# Altium schematic sheet Big_logger.SchDoc
size A1
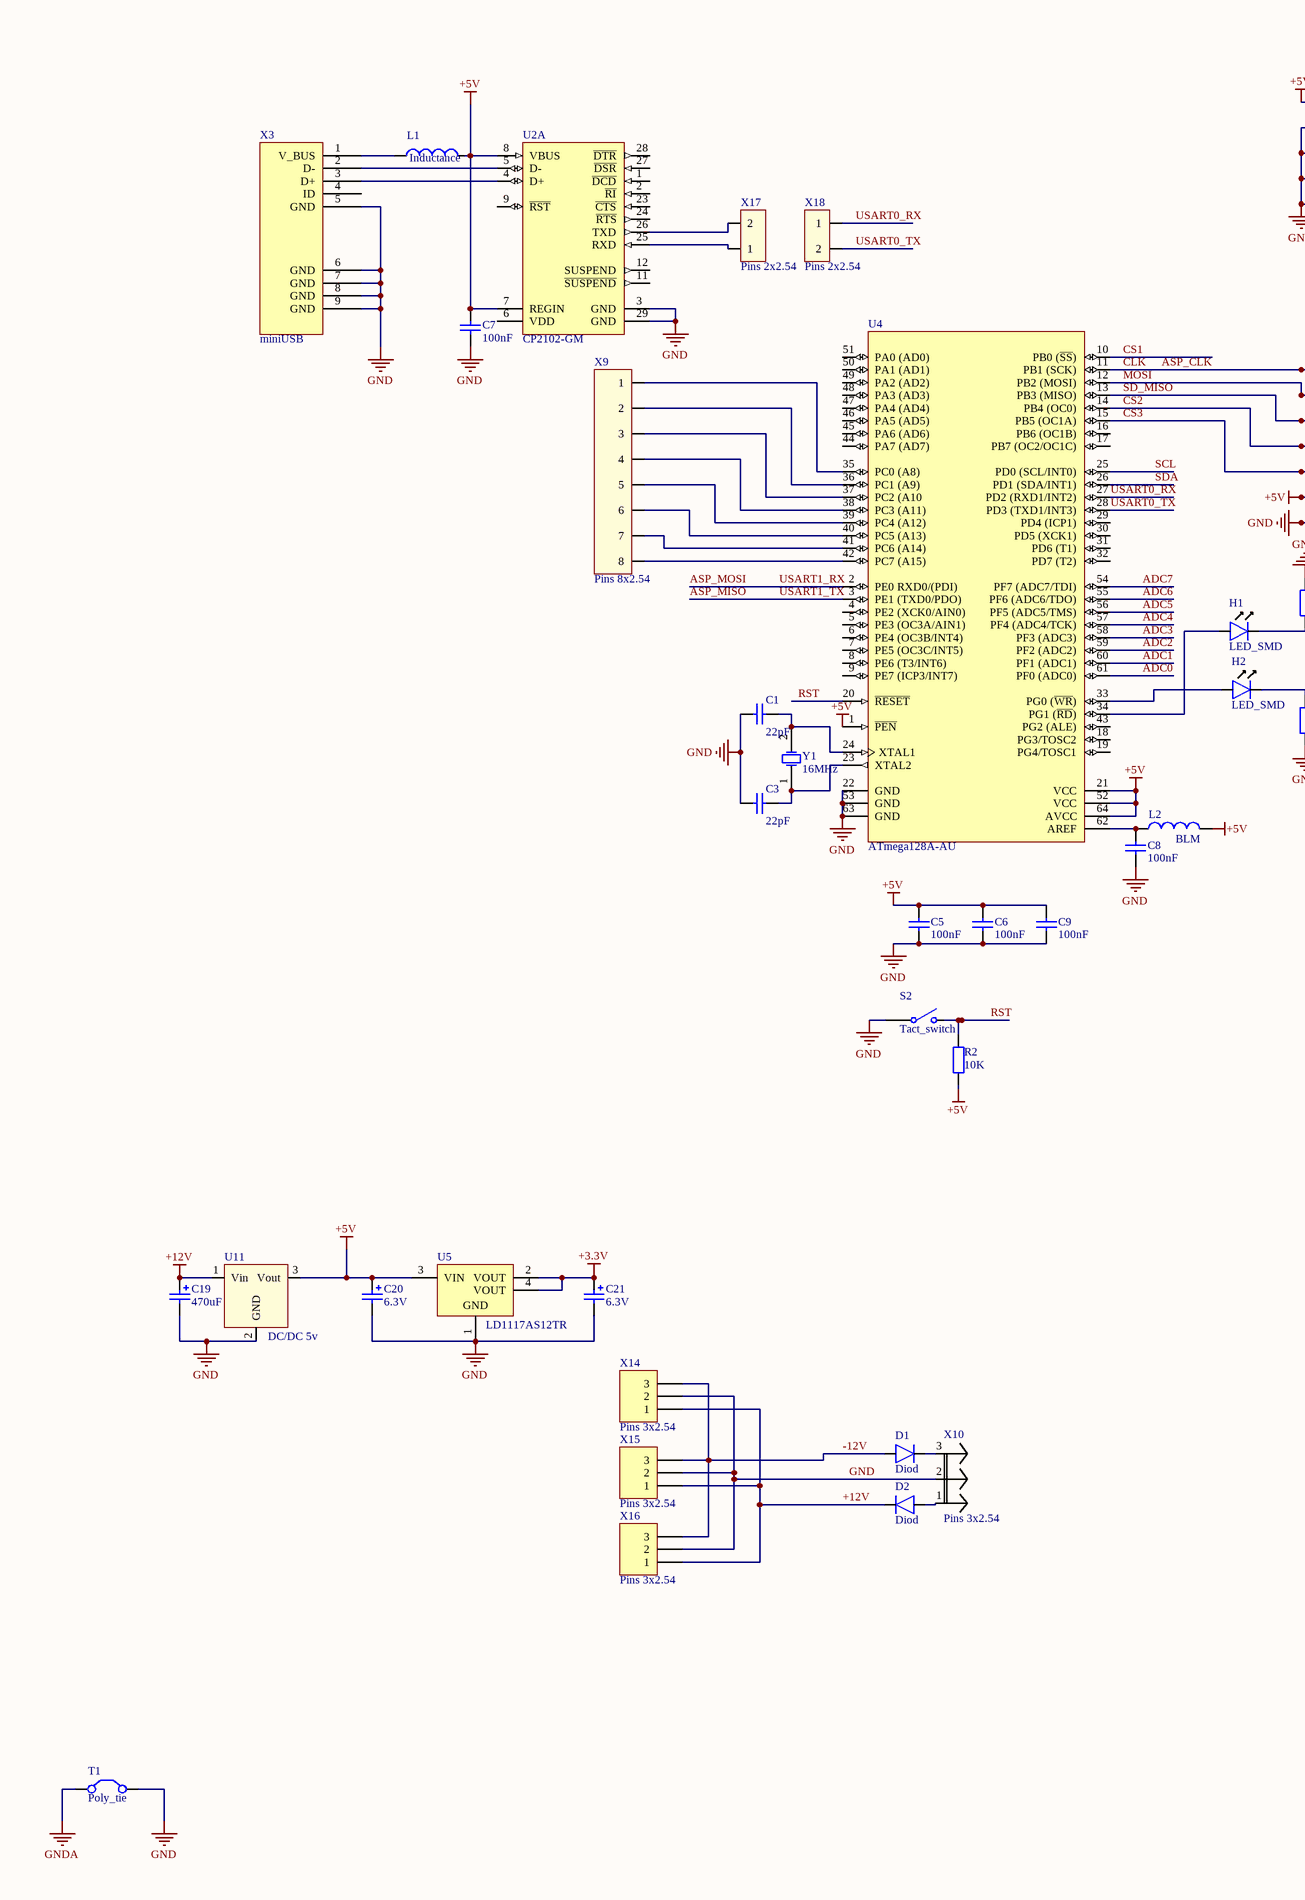
[diagram p0: Big_logger.SchDoc, left]
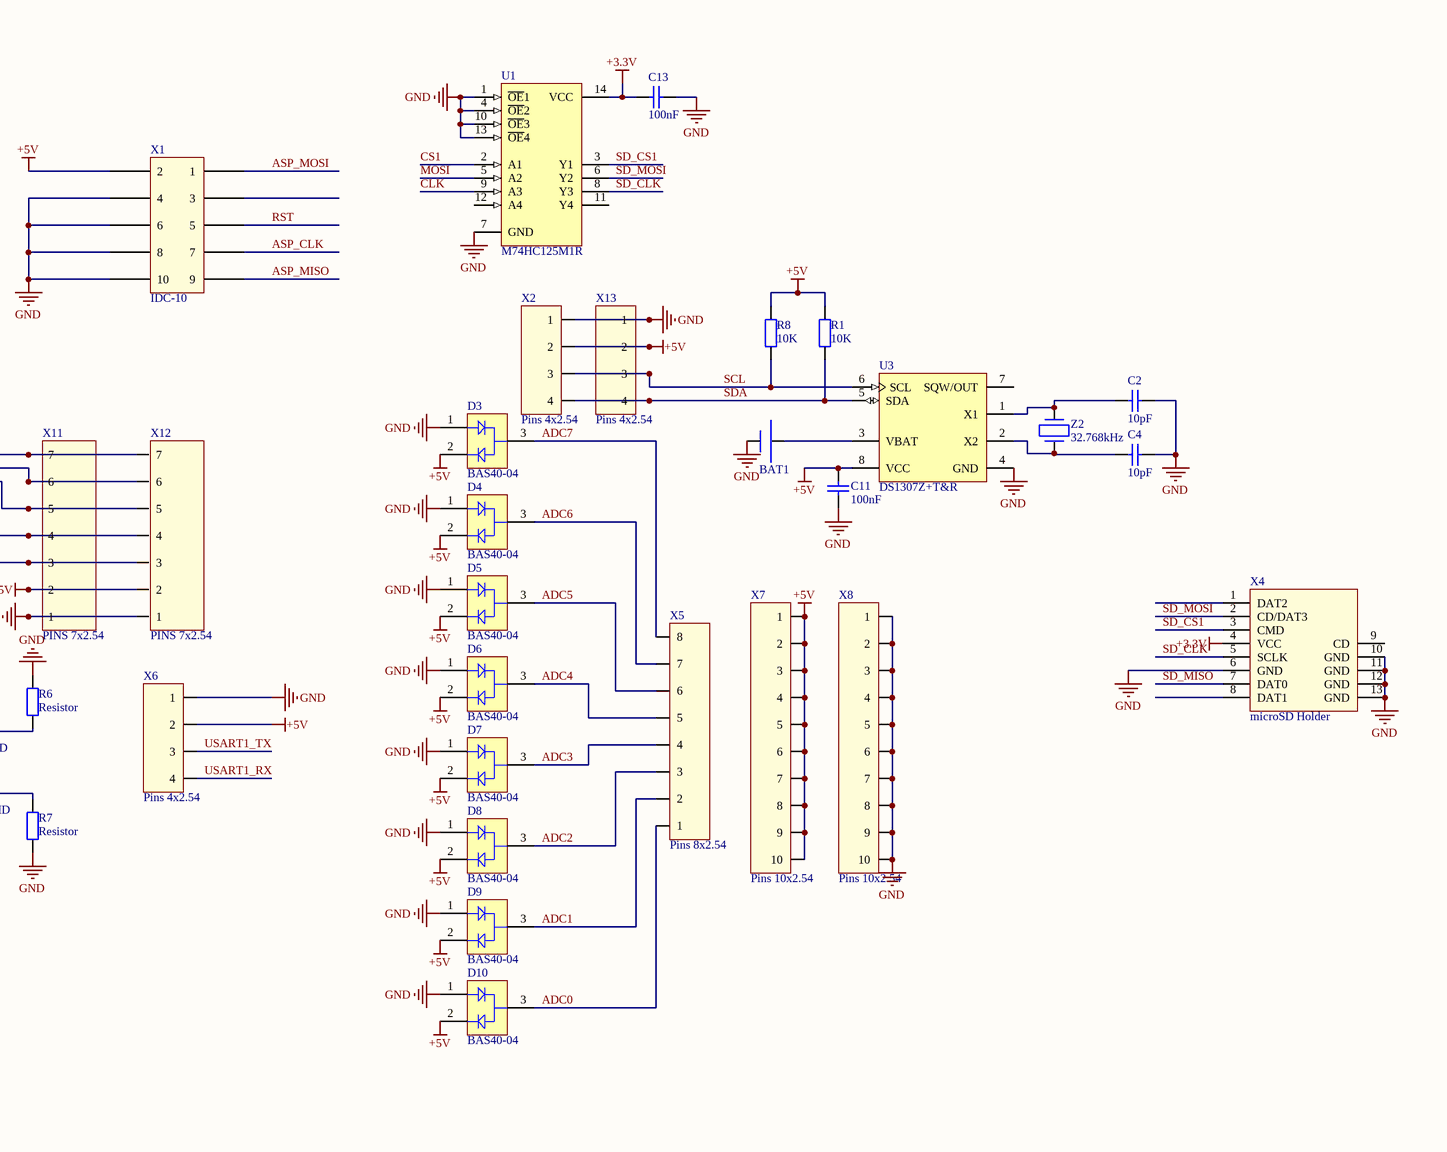
[diagram p1: Big_logger.SchDoc, right]

## Parts
BAT1  CR2032_Holder_BH-642  [BH-642(CR2032)]  (value not drawn)
C1  22pF  [C0805]
C2  10pF  [C0805]
C3  22pF  [C0805]
C4  10pF  [C0805]
C5  100nF  [C0805]
C6  100nF  [C0805]
C7  100nF  [C0805]
C8  100nF  [C0805]
C9  100nF  [C0805]
C11  100nF  [C0805]
C13  100nF  [C0805]
C19  470uF  [Cap_El_SMD_10mm]
C20  6.3V  [CAP_EL_SMD_6.3mm]
C21  6.3V  [CAP_EL_SMD_6.3mm]
D1  Diod  [SMB_DIODE]
D2  Diod  [SMB_DIODE]
D3  BAS40-04  [INF-SOT23_N]
D4  BAS40-04  [INF-SOT23_N]
D5  BAS40-04  [INF-SOT23_N]
D6  BAS40-04  [INF-SOT23_N]
D7  BAS40-04  [INF-SOT23_N]
D8  BAS40-04  [INF-SOT23_N]
D9  BAS40-04  [INF-SOT23_N]
D10  BAS40-04  [INF-SOT23_N]
H1  LED_SMD  [C0805]
H2  LED_SMD  [C0805]
L1  Inductance  [L0805]
L2  BLM  [L0805]
R1  10K  [R0805]
R2  10K  [R0805]
R6  Resistor  [R0805]
R7  Resistor  [R0805]
R8  10K  [R0805]
S2  Tact_switch  [Tact_switch_smd]
T1  Poly_tie  [POLY_TIE_1x2]
U1  M74HC125M1R  [SO14_N]
U2  CP2102-GM  [SLAB-QFN-28-3125x3125TP_N]  (part A of 2)
U3  DS1307Z+T&R  [S8+2_N]
U4  ATmega128A-AU  [64A_N]
U5  LD1117AS12TR  [SOT-223_N]
U11  DC/DC 5v  [DC/DC R-78E]
X1  IDC-10  [IDC-10]
X2  Pins 4x2.54  [Pins 4x2.54]
X3  miniUSB  [miniUSB]
X4  microSD Holder  [microSD_TFC08WP01FAR1KHC]
X5  Pins 8x2.54  [Pins 8x2.54]
X6  Pins 4x2.54  [Pins 4x2.54]
X7  Pins 10x2.54  [Pins 10x2.54]
X8  Pins 10x2.54  [Pins 10x2.54]
X9  Pins 8x2.54  [Pins 8x2.54]
X10  Pins 3x2.54  [Pins 3x2.54]
X11  PINS 7x2.54  [PINS 7X2.54]
X12  PINS 7x2.54  [PINS 7X2.54]
X13  Pins 4x2.54  [Pins 4x2.54]
X14  Pins 3x2.54  [Pins 3x2.54]
X15  Pins 3x2.54  [Pins 3x2.54]
X16  Pins 3x2.54  [Pins 3x2.54]
X17  Pins 2x2.54  [Pins 2x2.54]
X18  Pins 2x2.54  [Pins 2x2.54]
Y1  16MHz  [HC-49SM]
Z2  32.768kHz  [Geyer KX - 327S 32.768kHz]

## Nets
+3.3V: C13.2 C21.1 U1.14(VCC) U5.2(VOUT) U5.4(VOUT) X4.4(VCC)
+5V: C5.2 C6.2 C7.2 C9.2 C11.2 C20.1 D3.2(K2) D4.2(K2) D5.2(K2) D6.2(K2) D7.2(K2) D8.2(K2) D9.2(K2) D10.2(K2) L1.2 L2.2 R1.2 R2.1 R8.2 U2.7(REGIN) U2.8(VBUS) U3.8(VCC) U4.1(~{PEN}) U4.21(VCC) U4.52(VCC) U4.64(AVCC) U5.3(VIN) U11.3(Vout) X1.2 X2.2 X6.2 X7.1 X7.2 X7.3 X7.4 X7.5 X7.6 X7.7 X7.8 X7.9 X7.10 X11.2 X12.2 X13.2
+12V: C19.1 D2.2 U11.1(Vin) X14.1 X15.1 X16.1
GND: BAT1.1 C1.1 C2.1 C3.1 C4.1 C5.1 C6.1 C7.1 C8.1 C9.1 C11.1 C13.1 C19.2 C20.2 C21.2 D3.1(A1) D4.1(A1) D5.1(A1) D6.1(A1) D7.1(A1) D8.1(A1) D9.1(A1) D10.1(A1) R6.2 R7.1 S2.1(COMMON) T1.2(C2) U1.1(~{OE}1) U1.4(~{OE}2) U1.7(GND) U1.10(~{OE}3) U1.13(~{OE}4) U2.3(GND) U2.29(GND) U3.4(GND) U4.22(GND) U4.53(GND) U4.63(GND) U5.1(GND) U11.2(GND) X1.4 X1.6 X1.8 X1.10 X2.1 X3.5(GND) X3.6(GND) X3.7(GND) X3.8(GND) X3.9(GND) X4.6(GND) X4.10(GND) X4.11(GND) X4.12(GND) X4.13(GND) X6.1 X8.1 X8.2 X8.3 X8.4 X8.5 X8.6 X8.7 X8.8 X8.9 X8.10 X10.2 X11.1 X12.1 X13.1 X14.2 X15.2 X16.2
GNDA: T1.1(C1)
-12V: D1.1 X14.3 X15.3 X16.3
ADC0: D10.3(C) U4.61(PF0_(ADC0)) X5.1
ADC1: D9.3(C) U4.60(PF1_(ADC1)) X5.2
ADC2: D8.3(C) U4.59(PF2_(ADC2)) X5.3
ADC3: D7.3(C) U4.58(PF3_(ADC3)) X5.4
ADC4: D6.3(C) U4.57(PF4_(ADC4/TCK)) X5.5
ADC5: D5.3(C) U4.56(PF5_(ADC5/TMS)) X5.6
ADC6: D4.3(C) U4.55(PF6_(ADC6/TDO)) X5.7
ADC7: D3.3(C) U4.54(PF7_(ADC7/TDI)) X5.8
ASP_CLK: U1.9(A3) U4.11(PB1_(SCK)) X1.7 X11.7 X12.7  [also labelled CLK]
ASP_MISO: U4.3(PE1_(TXD0/PDO)) X1.9 X6.3  [also labelled USART1_TX]
ASP_MOSI: U4.2(PE0_RXD0/(PDI)) X1.1 X6.4  [also labelled USART1_RX]
CS1: U1.2(A1) U4.10(PB0_(~{SS}))
CS2: U4.14(PB4_(OC0)) X11.4 X12.4
CS3: U4.15(PB5_(OC1A)) X11.3 X12.3
MOSI: U1.5(A2) U4.12(PB2_(MOSI)) X11.6 X12.6
RST: R2.2 S2.2(NO) U4.20(~{RESET}) X1.5
SCL: R8.1 U3.6(SCL) U4.25(PD0_(SCL/INT0)) X2.3 X13.3
SD_CLK: U1.8(Y3) X4.5(SCLK)
SD_CS1: U1.3(Y1) X4.3(CMD)
SD_MISO: U4.13(PB3_(MISO)) X4.7(DAT0) X11.5 X12.5
SD_MOSI: U1.6(Y2) X4.2(CD/DAT3)
SDA: R1.1 U3.5(SDA) U4.26(PD1_(SDA/INT1)) X2.4 X13.4
USART0_RX: U4.27(PD2_(RXD1/INT2)) X18.1
USART0_TX: U4.28(PD3_(TXD1/INT3)) X18.2
NetBAT1_2: BAT1.2 U3.3(VBAT)
NetC1_2: C1.2 U4.24(XTAL1) Y1.2(OSC2)
NetC2_2: C2.2 U3.1(X1) Z2.1
NetC3_2: C3.2 U4.23(XTAL2) Y1.1(OSC1)
NetC4_2: C4.2 U3.2(X2) Z2.2
NetC8_2: C8.2 L2.1 U4.62(AREF)
NetD1_2: D1.2 X10.3
NetD2_1: D2.1 X10.1
NetH1_1: H1.1 U4.34(PG1_(~{RD}))
NetH1_2: H1.2 R6.1
NetH2_1: H2.1 U4.33(PG0_(~{WR}))
NetH2_2: H2.2 R7.2
NetL1_1: L1.1 X3.1(V_BUS)
NetU2_4: U2.4(D+) X3.3(D+)
NetU2_5: U2.5(D-) X3.2(D-)
NetU2_25: U2.25(RXD) X17.1
NetU2_26: U2.26(TXD) X17.2
NetU4_35: U4.35(PC0_(A8)) X9.1
NetU4_36: U4.36(PC1_(A9)) X9.2
NetU4_37: U4.37(PC2_(A10) X9.3
NetU4_38: U4.38(PC3_(A11)) X9.4
NetU4_39: U4.39(PC4_(A12)) X9.5
NetU4_40: U4.40(PC5_(A13)) X9.6
NetU4_41: U4.41(PC6_(A14)) X9.7
NetU4_42: U4.42(PC7_(A15)) X9.8

Not connected (* = marked no-connect by the designer): U1 11(Y4) 12(A4); U2 1(~{DCD}) 2(~{RI}) 6(VDD) 9(~{RST}) 11(~{SUSPEND}) 12(SUSPEND) 23(~{CTS}) 24(~{RTS}) 27(~{DSR}) 28(~{DTR}); U3 7(SQW/OUT); U4 4(PE2_(XCK0/AIN0)) 5(PE3_(OC3A/AIN1)) 6(PE4_(OC3B/INT4)) 7(PE5_(OC3C/INT5)) 8(PE6_(T3/INT6)) 9(PE7_(ICP3/INT7)) 16(PB6_(OC1B)) 17(PB7_(OC2/OC1C)) 18(PG3/TOSC2) 19(PG4/TOSC1) 29(PD4_(ICP1)) 30(PD5_(XCK1)) 31(PD6_(T1)) 32(PD7_(T2)) 43(PG2_(ALE)) 44(PA7_(AD7)) 45(PA6_(AD6)) 46(PA5_(AD5)) 47(PA4_(AD4)) 48(PA3_(AD3)) 49(PA2_(AD2)) 50(PA1_(AD1)) 51(PA0_(AD0)); X1 3; X3 4(ID); X4 1(DAT2) 8(DAT1) 9(CD)

## Library data of the parts
C1-C9 C11 C13 = Condensator
C19-C21 = Cond_polar
D3-D10 = BAS40-04: Silicon Schottky Diode, -55 to 150 degC, SOT23, Reel, Green; Manufacturer: Infineon; Configuration: Dual; CT (max): 5 pF; Green: TRUE; IF (max): 120 mA; VF (max): 1,000 mV; VR (max): 40 V; PackageVersion: Apr-08; PackageReference: SOT23; PackageDescription: 3-Pin Small Outline Transistor Package, 1.3 x 2.9 mm Body, 0.95 mm Pitch; Supplier 1: Newark; Supplier Part Number 1: 25M7648; Supplier 2: Farnell; Supplier Part Number 2: 1056500RL; Supplier 3: Farnell; Supplier Part Number 3: 1056500; Packing: Reel; Mounting Technology: Surface Mount; PartNumber: BAS40-04; ComponentLink1Description: Manufacturer URL; ComponentLink1URL: http://www.infineon.com/; ComponentLink2Description: Datasheet; ComponentLink2URL: http://www.infineon.com/dgdl/bas40_bas140series.pdf?folderId=db3a30431400ef68011425f1ca2505e3&fileId=db3a304314dca389011518a57ed20e11; ComponentLink3Description: Package Specification; ComponentLink3URL: http://www.infineon.com/dgdl/SOT23-Package_Overview.pdf?folderId=db3a30431936bc4b0119532290053c66&fileId=db3a30431936bc4b0119533468123c85
L2 = Inductance
R1 R2 R8 = Resistor
U1 = M74HC125M1R: Quad Bus Buffer (3-State); Published: 8-Jun-2000; LatestRevisionDate: 13-Apr-2006; LatestRevisionNote: IPC-7351 Footprint Added.; DatasheetVersion: Sep-1993; PackageVersion: Sep-1998; PackageReference: SO14; Publisher: Altium Limited; PackageDescription: 14-Pin Small Outline Integrated Circuit 1.27 mm Pitch; Code_IPC: SOIC127P600-14; ComponentLink1Description: Manufacturer Link; ComponentLink1URL: http://www.st.com/; ComponentLink2Description: Datasheet; ComponentLink2URL: http://www.st.com/stonline/products/literature/ds/1894/m74hc125.pdf
U2 = CP2102-GM: Single-Chip USB to UART Bridge, 1024 Bytes EEPROM, -40 to 85 degC, 28-pin QFN, Tube; Manufacturer: Silicon Labs; Internal Oscillator: TRUE; Sub-Family: USB Bridges; DatasheetVersion: Rev. 1.5; PackageReference: QFN-28; PackageDescription: 28-Pin Quad-Flat No-Leads Package, Body 5 x 5 mm, Pitch 0.5 mm; Supplier 1: Digi-Key; Supplier Part Number 1: 336-1160-5-ND; Supplier 2: Farnell; Supplier Part Number 2: 9282130; Supplier 3: Newark; Supplier Part Number 3: 30K5635; Supplier 4: Mouser; Supplier Part Number 4: 634-CP2102-GM; EEPROM: 1024 Bytes; Mounting Technology: Surface Mount; Code_JEDEC: MO-220; Code_IPC: J-STD-020C; PartNumber: CP2102-GM; ComponentLink1Description: Manufacturer URL; ComponentLink1URL: http://www.silabs.com/; ComponentLink2Description: Datasheet; ComponentLink2URL: http://www.silabs.com/Support%20Documents/TechnicalDocs/CP2102-9.pdf; ComponentLink3Description: Package Specification; ComponentLink3URL: http://www.silabs.com/Support%20Documents/TechnicalDocs/C8051T61x.pdf
U3 = DS1307Z+T&R: 64 x 8, Serial, I2C Real-Time Clock, 5.0V, 8-Pin SO, 0 to 70 degC, Pb-Free, Reel; DatasheetVersion: 10-Feb-2008; PackageVersion: revC, 2010; PackageReference: S8+2; PackageDescription: 8-Pin Small-Outline IC, Narrow (0.15in), 1.27 mm Pitch, SOIC (N), Pb-Free; Code_JEDEC: MS-012-AA; Code_IPC: SOIC127P600-8; ComponentLink1Description: Manufacturer URL; ComponentLink1URL: http://www.maxim-ic.com; ComponentLink2Description: Datasheet; ComponentLink2URL: http://datasheets.maxim-ic.com/en/ds/DS1307.pdf; ComponentLink3Description: Package Specification; ComponentLink3URL: http://pdfserv.maxim-ic.com/package_dwgs/21-0041.PDF
U4 = ATmega128A-AU: 8-bit AVR Microcontroller, 128KB Flash, 4KB EEPROM, 4KB SRAM, 64-pin TQFP, Industrial Grade (-40°C to 85°C); Published: 1-Apr-2010; DatasheetVersion: revE, Feb-2010; PackageVersion: revB, Oct-2001; PackageReference: 64A; Publisher: Altium Limited; PackageDescription: 64-Pin Plastic Thin Profile Quad Flat Pack, 14 x 14 x 1.0 mm Body, 0.8 mm Pitch (TQFP); Supplier 1: Digi-Key; Supplier Part Number 1: ATMEGA128A-AU-ND; Supplier 2: Farnell; Supplier Part Number 2: 1773397; Supplier 3: Mouser; Supplier Part Number 3: 556-ATMEGA128A-AU; Code_JEDEC: MS-026-AEB; ComponentLink1Description: Manufacturer Link; ComponentLink1URL: http://www.atmel.com/products/avr/default.asp?; ComponentLink2Description: ATmega128A Datasheet; ComponentLink2URL: http://www.atmel.com/dyn/resources/prod_documents/doc8151.pdf; ComponentLink3Description: ATmega128A Summary; ComponentLink3URL: http://www.atmel.com/dyn/resources/prod_documents/8151S.pdf; ComponentLink4Description: Atmel.com Home; ComponentLink4URL: http://www.atmel.com
U5 = LD1117AS12TR: 1A, Low Drop Positive Voltage Regulator, 1.2V, 4-Pin SOT-223, Tape and Reel; DatasheetVersion: Dec-2011; PackageVersion: 2010; PackageReference: SOT-223; PackageDescription: 4-Pin SOT-223 Package, 6.5 x 3.5 mm Body, 2.3 mm Pitch, 7 mm Lead Span; PartNumber: LD1117AS12TR; ComponentLink1Description: Manufacturer URL; ComponentLink1URL: http://www.st.com; ComponentLink2Description: Datasheet; ComponentLink2URL: http://www.st.com/internet/com/TECHNICAL_RESOURCES/TECHNICAL_LITERATURE/DATASHEET/CD00002116.pdf
U11 = DC/DC R-78E
X4 = microSD
Y1 Z2 = Crystal Oscillator